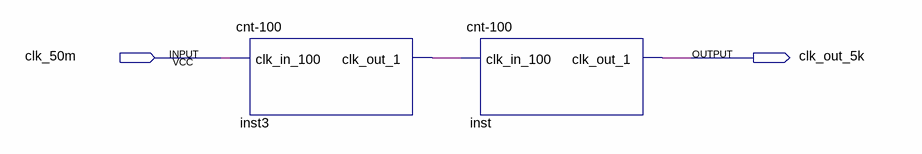
[diagram p0: schematic sheet]
// Quartus schematic clk_5k.bdf as structural Verilog: 2 symbols, 2 pins
module clk_5k (
  input  clk_50m,
  output clk_out_5k
);

  wire inst3_clk_out_1;

  \cnt-100  inst3 (.clk_in_100(clk_50m), .clk_out_1(inst3_clk_out_1));
  \cnt-100  inst (.clk_in_100(inst3_clk_out_1), .clk_out_1(clk_out_5k));
endmodule
